# Altium schematic sheet master_schematic.SchDoc
size A4
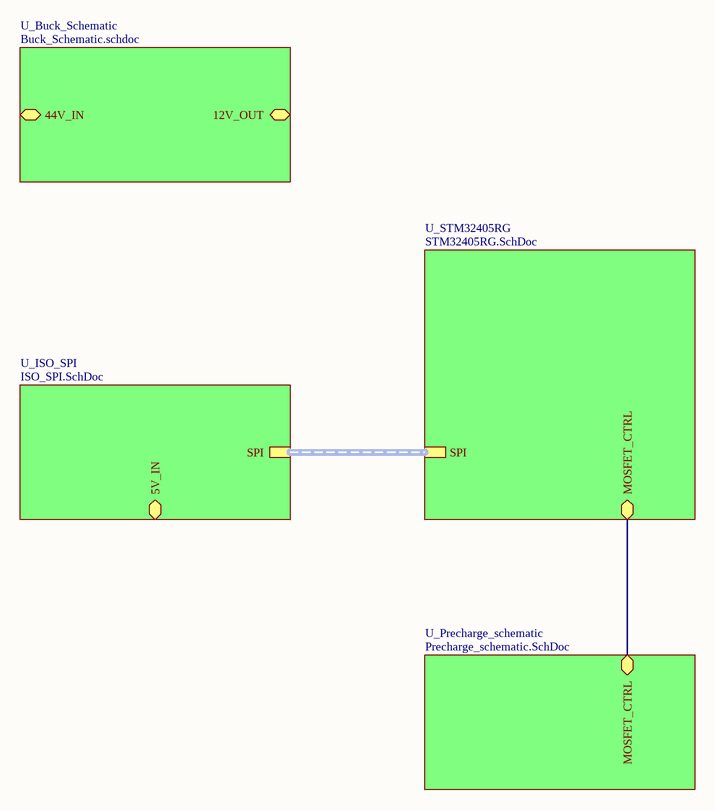
[diagram p0: master_schematic.SchDoc]

## Sub-sheets
U_Buck_Schematic = Buck_Schematic.schdoc: 44V_IN (bidir), 12V_OUT (bidir)
U_ISO_SPI = ISO_SPI.SchDoc: SPI (harness SPI), 5V_IN (bidir)
U_Precharge_schematic = Precharge_schematic.SchDoc: MOSFET_CTRL (bidir)
U_STM32405RG = STM32405RG.SchDoc: SPI (harness SPI), MOSFET_CTRL (bidir)

## Nets
(unnamed): sheet U_Precharge_schematic/MOSFET_CTRL, sheet U_STM32405RG/MOSFET_CTRL

## Buses and harness runs
harness sheet U_ISO_SPI/SPI = sheet U_STM32405RG/SPI